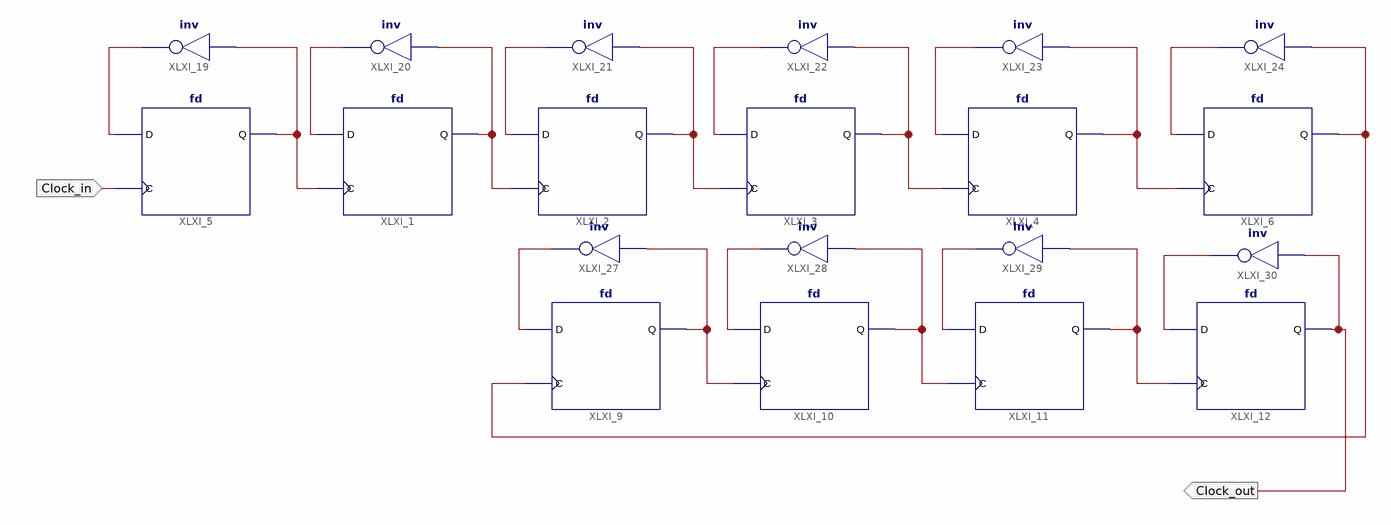
[diagram p0: schematic sheet 1]
// Xilinx ISE schematic CD1.sch (spartan6) as structural Verilog: 20 symbols, 2 ports
module CD1 (
  input  Clock_in,
  output Clock_out
);

  wire XLXN_13, XLXN_14, XLXN_15, XLXN_16, XLXN_17, XLXN_21, XLXN_22, XLXN_23, XLXN_29, XLXN_30, XLXN_31,
       XLXN_32, XLXN_33, XLXN_34, XLXN_37, XLXN_38, XLXN_39, XLXN_40, XLXN_54;

  fd XLXI_2 (.C(XLXN_14), .D(XLXN_31), .Q(XLXN_15));
  fd XLXI_3 (.C(XLXN_15), .D(XLXN_32), .Q(XLXN_16));
  fd XLXI_4 (.C(XLXN_16), .D(XLXN_33), .Q(XLXN_17));
  fd XLXI_5 (.C(Clock_in), .D(XLXN_29), .Q(XLXN_13));
  fd XLXI_6 (.C(XLXN_17), .D(XLXN_34), .Q(XLXN_54));
  fd XLXI_9 (.C(XLXN_54), .D(XLXN_37), .Q(XLXN_21));
  fd XLXI_10 (.C(XLXN_21), .D(XLXN_38), .Q(XLXN_22));
  fd XLXI_11 (.C(XLXN_22), .D(XLXN_39), .Q(XLXN_23));
  fd XLXI_12 (.C(XLXN_23), .D(XLXN_40), .Q(Clock_out));
  fd XLXI_1 (.C(XLXN_13), .D(XLXN_30), .Q(XLXN_14));
  not XLXI_19 (XLXN_29, XLXN_13);
  not XLXI_20 (XLXN_30, XLXN_14);
  not XLXI_21 (XLXN_31, XLXN_15);
  not XLXI_22 (XLXN_32, XLXN_16);
  not XLXI_23 (XLXN_33, XLXN_17);
  not XLXI_24 (XLXN_34, XLXN_54);
  not XLXI_27 (XLXN_37, XLXN_21);
  not XLXI_28 (XLXN_38, XLXN_22);
  not XLXI_29 (XLXN_39, XLXN_23);
  not XLXI_30 (XLXN_40, Clock_out);
endmodule
